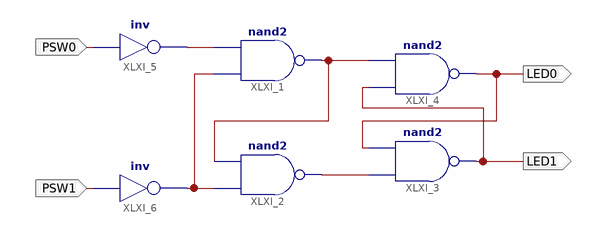
[diagram p0: schematic sheet 1]
// Xilinx ISE schematic lab6_dlatch.sch (spartan3) as structural Verilog: 6 symbols, 4 ports
module lab6_dlatch (
  input  PSW0,
  input  PSW1,
  output LED0,
  output LED1
);

  wire XLXN_1, XLXN_4, XLXN_5, XLXN_6;

  nand XLXI_2 (XLXN_6, XLXN_4, XLXN_5);
  nand XLXI_3 (LED1, XLXN_6, LED0);
  nand XLXI_4 (LED0, LED1, XLXN_5);
  not XLXI_5 (XLXN_1, PSW0);
  not XLXI_6 (XLXN_4, PSW1);
  nand XLXI_1 (XLXN_5, XLXN_4, XLXN_1);
endmodule
